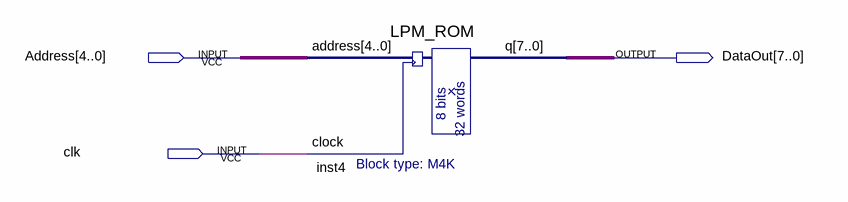
[diagram p0: schematic sheet]
// Quartus schematic MyMemory.bdf as structural Verilog: 1 symbols, 3 pins
module MyMemory (
  input  [4:0] Address,
  input  clk,
  output [7:0] DataOut
);

  LPM_ROM inst4 (.address(Address), .clock(clk), .q(DataOut));
endmodule
